# EAGLE design placa do circuito do carregador (EAGLE 7.3.0)
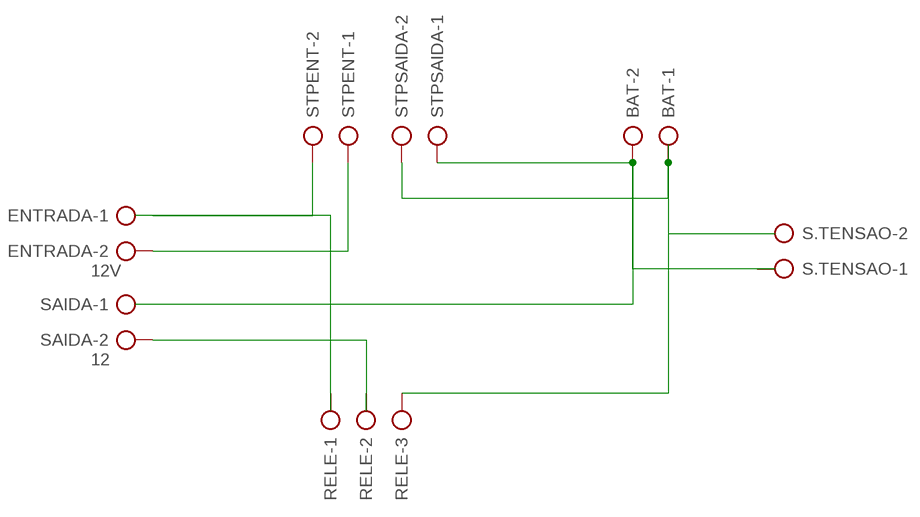
[diagram p0: schematic, sheet 1]

## Parts
BAT  AK300/2  [AK300/2]
ENTRADA  12V  AK300/2  [AK300/2]
RELE  AK500/3-H  [AK500/3-H]
S.TENSAO  AK300/2  [AK300/2]
SAIDA  12  AK300/2  [AK300/2]
STPENT  AK300/2  [AK300/2]
STPSAIDA  AK300/2  [AK300/2]

## Nets
N$1: ENTRADA.1 STPENT.2
N$3: BAT.2 STPSAIDA.1
N$4: ENTRADA.2 STPENT.1
N$7: SAIDA.2
N$11: BAT.1 RELE.3 STPSAIDA.2
Unconnected: RELE.1 RELE.2 S.TENSAO.1 S.TENSAO.2 SAIDA.1

## Library data of the parts
BAT ENTRADA S.TENSAO SAIDA STPENT STPSAIDA = con-ptr500:AK300/2: CONNECTOR; OC_FARNELL: unknown; OC_NEWARK: unknown
RELE = con-ptr500:AK500/3-H: CONNECTOR Aug. 2004 / PTR Meßtechnik: Die Bezeichnung der Serie AK505 wurde geändert. Es handelt sich hierbei um AK500 in horizontaler Ausführung.; OC_FARNELL: unknown; OC_NEWARK: unknown

## Board
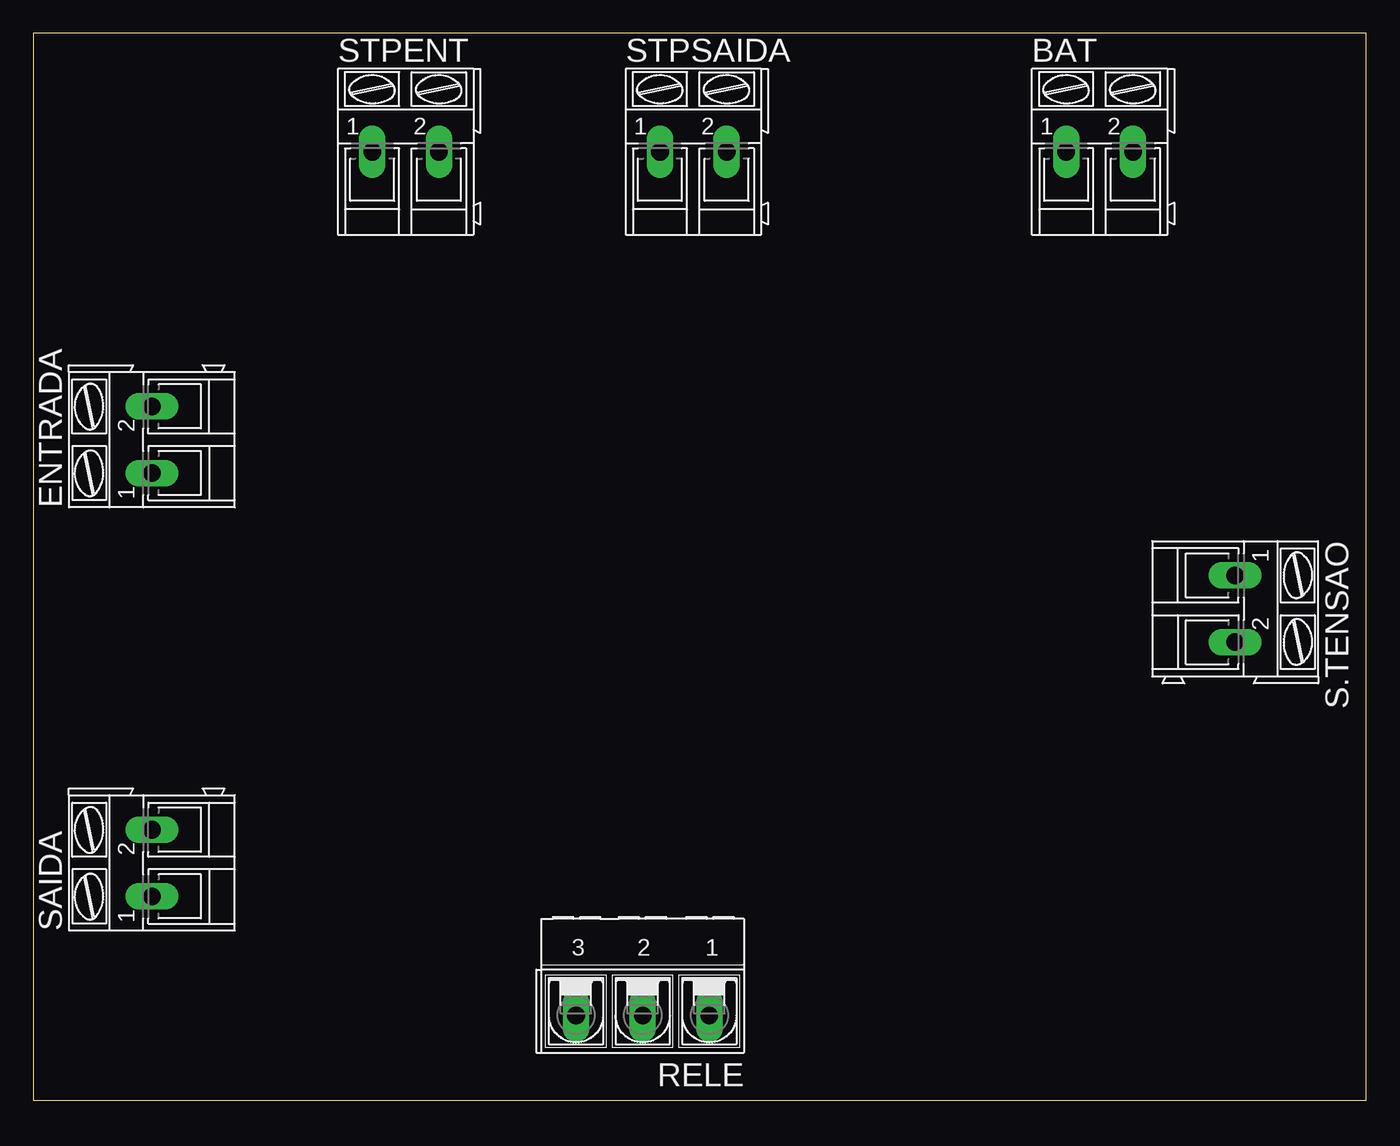
[diagram p1: board, top side]
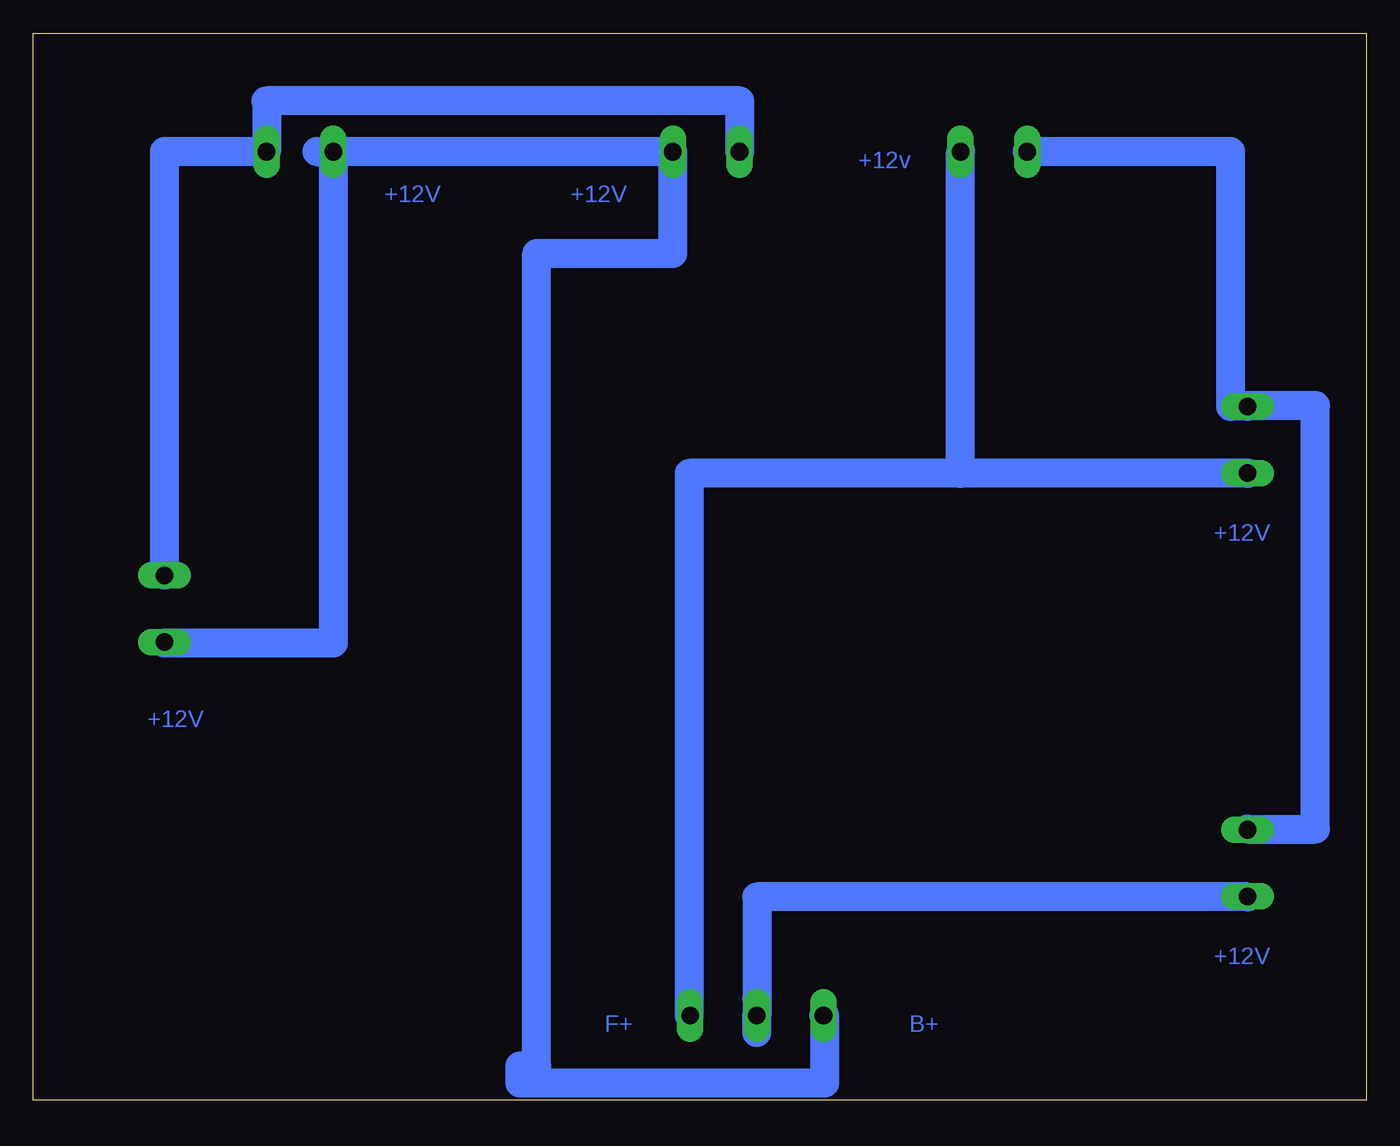
[diagram p2: board, bottom side, seen from below]

Size 100 x 80 mm. Coordinates in mm from the lower left corner, seen from the top.
Outline: 0,0 100,0 100,80 0,80 0,0
Copper layers (1*16): Top 0.035mm / dielectric 1.5mm / Bottom 0.035mm
Design rules "default": minimum track width 10mil, minimum drill 24mil, track to track 8mil, track to pad 8mil, pad to pad 8mil, via to via 8mil, smd to smd 8mil, copper to edge 40mil, drill to drill 8mil, minimum pad ring 10mil, minimum via ring 8mil, stop-mask expansion 4mil, vias tented up to drill 0mil, thermal gap 10mil

### Footprints (pad centres in the part's own frame; a part is rotated, then mirrored left to right if it is on the bottom)
AK300/2 = drill 1.321 long: 1 -2.515,0; 2 2.489,0
AK500/3-H = drill 1.321 long: 1 -5.004,0; 2 0,0; 3 5.004,0

### Placement (x,y rotation side)
BAT  80.01,71.12 0 top
ENTRADA  8.89,49.53 90 top
RELE  45.72,6.35 180 top
S.TENSAO  90.17,36.83 270 top
SAIDA  8.89,17.78 90 top
STPENT  27.94,71.12 0 top
STPSAIDA  49.53,71.12 0 top

### Tracks (layer width: path | path; a pad name or v marks a point on that pad's centre or on a via)
N$1
  Bottom 2.184: ENTRADA.1 30.48,47.02 30.48,46.99 30.43,46.99 STPENT.2
N$3
  Bottom 2.184: STPSAIDA.1 46.99,71.12 46.99,74.93 82.5,74.93 | 82.55,74.93 82.5,74.93 | 82.5,74.93 BAT.2
N$4
  Bottom 2.184: 8.89,20.32 3.81,20.32 3.81,52.07 10.16,52.07 | ENTRADA.2 10.16,52.02 10.16,52.07 | 10.16,52.07 10.16,71.12 STPENT.1
N$8
  Bottom 2.184: 82.55,71.12 90.17,71.12 90.17,39.37
N$10
  Bottom 2.184: 8.89,15.24 45.72,15.24 45.72,7.62 45.72,6.35 45.72,5.08
N$11
  Bottom 2.184: 90.17,34.29 77.47,34.29 77.47,71.12 | RELE.3 40.64,6.35 40.64,1.27 63.5,1.27 63.5,2.54 62.23,2.54 62.23,63.5 52.02,63.5 STPSAIDA.2 77.47,71.12 | 77.47,71.12 BAT.1 78.74,71.12
N$12
  Bottom 2.184: 8.89,46.99 50.8,46.99 50.8,6.35

### Text on the board
Bottom: +12v | +12V | +12V | +12V | +12V | +12V | B+ | F+